# Altium schematic sheet 12_CONSOLE.SchDoc
size 420 x 297 mm; SheetNumber: 21; SheetTotal: 36
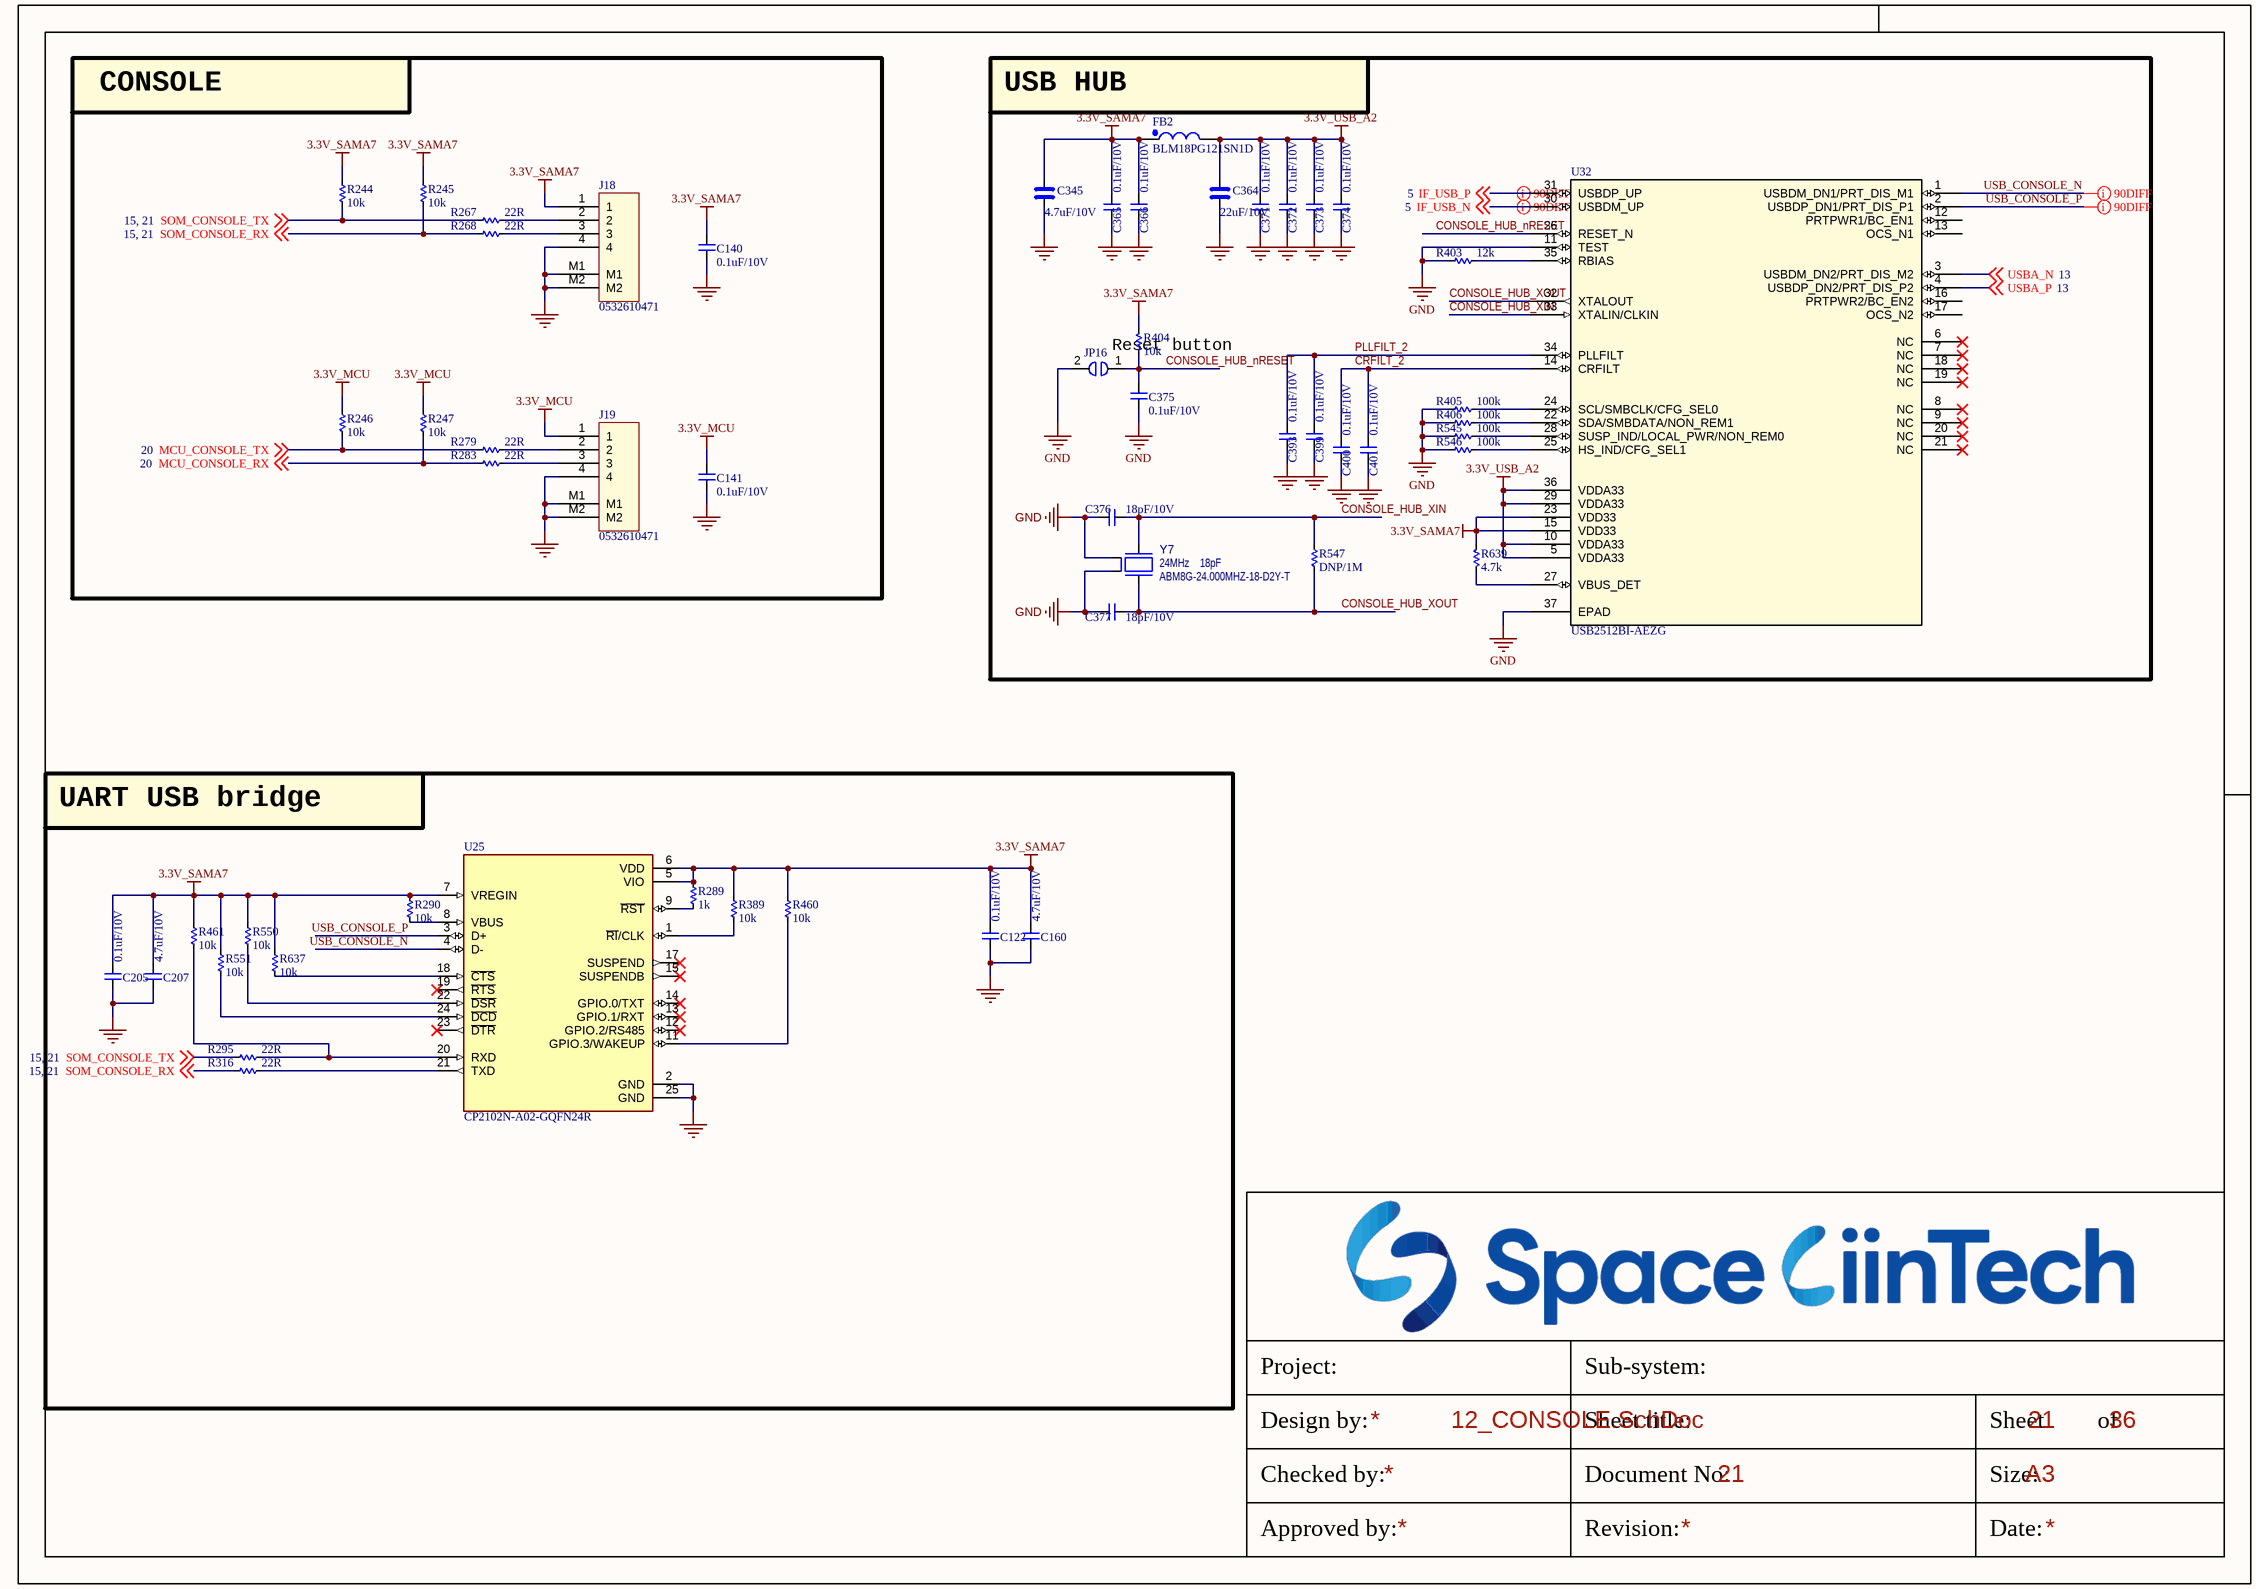
[diagram p0: 12_CONSOLE.SchDoc]

## Parts
C122  0.1uF/10V  [CAP_C_1005X60]
C140  0.1uF/10V  [CAP_C_1005X60]
C141  0.1uF/10V  [CAP_C_1005X60]
C160  4.7uF/10V  [CAP_C_1005X60]
C205  0.1uF/10V  [CAP_C_1005X60]
C207  4.7uF/10V  [CAP_C_1005X60]
C345  4.7uF/10V  [CAP_C_1608X80]
C364  22uF/10V  [CAP_C_1608X80]
C365  0.1uF/10V  [CAP_C_1005X60]
C366  0.1uF/10V  [CAP_C_1005X60]
C371  0.1uF/10V  [CAP_C_1005X60]
C372  0.1uF/10V  [CAP_C_1005X60]
C373  0.1uF/10V  [CAP_C_1005X60]
C374  0.1uF/10V  [CAP_C_1005X60]
C375  0.1uF/10V  [CAP_C_1005X60]
C376  18pF/10V  [CAP_C_1005X60]
C377  18pF/10V  [CAP_C_1005X60]
C393  0.1uF/10V  [CAP_C_1005X60]
C399  0.1uF/10V  [CAP_C_1005X60]
C400  0.1uF/10V  [CAP_C_1005X60]
C401  0.1uF/10V  [CAP_C_1005X60]
FB2  BLM18PG121SN1D  [IND_C_1608X60]
J18  0532610471  [MOLEX_0532610471]
J19  0532610471  [MOLEX_0532610471]
JP16  (no value)  [TESTPOINT_SHORT_120X100_60]
R244  10k  [RES_C_1005X40]
R245  10k  [RES_C_1005X40]
R246  10k  [RES_C_1005X40]
R247  10k  [RES_C_1005X40]
R267  22R  [RES_C_1005X40]
R268  22R  [RES_C_1005X40]
R279  22R  [RES_C_1005X40]
R283  22R  [RES_C_1005X40]
R289  1k  [RES_C_1005X40]
R290  10k  [RES_C_1005X40]
R295  22R  [RES_C_1005X40]
R316  22R  [RES_C_1005X40]
R389  10k  [RES_C_1005X40]
R403  12k  [RES_C_1005X40]
R404  10k  [RES_C_1005X40]
R405  100k  [RES_C_1005X40]
R406  100k  [RES_C_1005X40]
R460  10k  [RES_C_1005X40]
R461  10k  [RES_C_1005X40]
R545  100k  [RES_C_1005X40]
R546  100k  [RES_C_1005X40]
R547  DNP/1M  [RES_C_1005X40]
R550  10k  [RES_C_1005X40]
R551  10k  [RES_C_1005X40]
R637  10k  [RES_C_1005X40]
R639  4.7k  [RES_C_1005X40]
U25  CP2102N-A02-GQFN24R  [QFN50P400X400X80-25N]
U32  USB2512BI-AEZG  [QFN36_6X6MC_MCH]
Y7  value 24MHz  Load Capacitance: 18pF  Manufacturer Part Number 1: ABM8G-24.000MHZ-18-D2Y-T  [CRYSTAL_ABM8G]  (hidden comment: Crystal 4 Pins)

## Blocks framed on the sheet
CONSOLE: C140 C141 J18 J19 R244-R247 R267 R268 R279 R283
USB HUB: C345 C364-C366 C371-C377 C393 C399-C401 FB2 JP16 R403-R406 R545-R547 R639 U32 Y7
UART USB bridge: C122 C160 C205 C207 R289 R290 R295 R316 R389 R460 R461 R550 R551 R637 U25

## Nets
3.3V_MCU: C141.2 J19.1 R246.2 R247.2
3.3V_SAMA7: C122.1 C140.2 C160.1 C205.1 C207.1 C345.1 C365.2 C366.2 FB2.1 J18.1 R244.2 R245.2 R289.2 R290.2 R389.2 R404.1 R460.2 R461.2 R550.2 R551.2 R637.2 R639.1 U25.5(VIO) U25.6(VDD) U25.7(VREGIN) U32.15(VDD33) U32.23(VDD33)
3.3V_USB_A2: C364.1 C371.2 C372.2 C373.2 C374.2 FB2.2 U32.5(VDDA33) U32.10(VDDA33) U32.29(VDDA33) U32.36(VDDA33)
GND: C122.2 C140.1 C141.1 C160.2 C205.2 C207.2 C345.2 C364.2 C365.1 C366.1 C371.1 C372.1 C373.1 C374.1 C375.1 C376.2 C377.2 C393.1 C399.1 C400.1 C401.1 J18.4 J18.M1 J18.M2 J19.4 J19.M1 J19.M2 JP16.2 R403.1 R405.1 R406.1 R545.1 R546.1 U25.2(GND) U25.25(GND) U32.11(TEST) U32.37(EPAD) Y7.2(GND) Y7.4(GND)
CONSOLE_HUB_nRESET: C375.2 JP16.1 R404.2 U32.26(RESET_N)
CONSOLE_HUB_XIN: C376.1 R547.1 U32.33(XTALIN/CLKIN) Y7.3(Osc2)
CONSOLE_HUB_XOUT: C377.1 R547.2 U32.32(XTALOUT) Y7.1(Osc1)
CRFILT_2: C400.2 C401.2 U32.14(CRFILT)
IF_USB_N: U32.30(USBDM_UP) ; off-sheet IF_USB_N
IF_USB_P: U32.31(USBDP_UP) ; off-sheet IF_USB_P
MCU_CONSOLE_RX: R247.1 R283.2 ; off-sheet MCU_CONSOLE_RX
MCU_CONSOLE_TX: R246.1 R279.2 ; off-sheet MCU_CONSOLE_TX
PLLFILT_2: C393.2 C399.2 U32.34(PLLFILT)
SOM_CONSOLE_RX: R245.1 R268.2 R316.2 ; off-sheet SOM_CONSOLE_RX
SOM_CONSOLE_TX: R244.1 R267.2 R295.2 ; off-sheet SOM_CONSOLE_TX
USB_CONSOLE_N: U25.4(D-) U32.1(USBDM_DN1/PRT_DIS_M1)
USB_CONSOLE_P: U25.3(D+) U32.2(USBDP_DN1/PRT_DIS_P1)
USBA_N: U32.3(USBDM_DN2/PRT_DIS_M2) ; off-sheet USBA_N
USBA_P: U32.4(USBDP_DN2/PRT_DIS_P2) ; off-sheet USBA_P
NetJ18_2: J18.2 R267.1
NetJ18_3: J18.3 R268.1
NetJ19_2: J19.2 R279.1
NetJ19_3: J19.3 R283.1
NetR289_1: R289.1 U25.9(~{RST})
NetR290_1: R290.1 U25.8(VBUS)
NetR295_1: R295.1 R461.1 U25.20(RXD)
NetR316_1: R316.1 U25.21(TXD)
NetR389_1: R389.1 U25.1(~{RI}/CLK)
NetR403_2: R403.2 U32.35(RBIAS)
NetR405_2: R405.2 U32.24(SCL/SMBCLK/CFG_SEL0)
NetR406_2: R406.2 U32.22(SDA/SMBDATA/NON_REM1)
NetR460_1: R460.1 U25.11(GPIO.3/WAKEUP)
NetR545_2: R545.2 U32.28(SUSP_IND/LOCAL_PWR/NON_REM0)
NetR546_2: R546.2 U32.25(HS_IND/CFG_SEL1)
NetR550_1: R550.1 U25.22(~{DSR})
NetR551_1: R551.1 U25.24(~{DCD})
NetR637_1: R637.1 U25.18(~{CTS})
NetR639_2: R639.2 U32.27(VBUS_DET)

Not connected (* = marked no-connect by the designer): U25 12(GPIO.2/RS485)* 13(GPIO.1/RXT)* 14(GPIO.0/TXT)* 15(SUSPENDB)* 17(SUSPEND)* 19(~{RTS})* 23(~{DTR})*; U32 6(NC)* 7(NC)* 8(NC)* 9(NC)* 12(PRTPWR1/BC_EN1) 13(OCS_N1) 16(PRTPWR2/BC_EN2) 17(OCS_N2) 18(NC)* 19(NC)* 20(NC)* 21(NC)*

## Layout directives
differential pair; differential pair class DIFF90: IF_USB_N, IF_USB_P, USB_CONSOLE_N, USB_CONSOLE_P

## Notes on the sheet
- (near JP16) Reset button
- Project:
- Sub-system:
- Design by:
- Sheet title:
- Sheet
- of
- Checked by:
- Approved by:
- Revision:
- Document No:
- Size:
- Date:
- A3

## Library data of the parts
C122 C140 C141 C160 C205 C207 = _CAP_C_2: CAP
C345 C364 = _CAP_C_High_2: CAP CHIP High Value
C365 C366 C371-C377 C393 C399-C401 = _CAP_C_2: CAP CHIP
FB2 = _IND
J18 J19 = Header 4x1_2M
JP16 = JUMPER_1_1
R244-R247 R267 R268 R279 R283 R289 R290 R295 R316 R389 R403-R406 R460 R461 R545-R547 R550 R551 R637 R639 = _RES_B_2: RES
U25 = IC_USB_toUART_CP2102N-A02-GQFN24R: Value: *; MP: CP2102N-A02-GQFN24R; Package: None; Availability: Unavailable; Price: None
U32 = IC_USB_HUB_USB2512BI-AEZG: Description; Manufacturer_Name: Microchip; Copyright: Copyright (C) 2026 Ultra Librarian. All rights reserved.; Manufacturer_Part_Number: USB2512BI-AEZG; RefDes: RefDes; Type: Type
Y7 = OSC1047: Crystal; Manufacturer 1: Abracon Corporation; Description_: CRYSTAL 24MHz 18pF SMD ABM8G; Dev Tools Status: Production; Owner: Mark Loper; Populated: DNP; MCHP-ID: OSC1047; Revision: 1; Symbol: Crystal 4 Pins; Status: MCL Design; ComponentLink1URL: https://chn-vm-apps.microchip.com/mchprepo/parts/Datasheets/ABM8G.pdf; ComponentLink1Description: SVN Datasheet; ComponentLink2URL: C:\ALTIUM_WORK\00001_MCHP-CDB\Datasheets\ABM8G.pdf; ComponentLink2Description: Local Datasheet; ComponentLink3URL: C:\ALTIUM_WORK\00001_MCHP-CDB\Library\LibraryRefs\Crystal 4 Pins.SchLib; ComponentLink3Description: Open Symbol; ComponentLink4URL: C:\ALTIUM_WORK\00001_MCHP-CDB\Library\Footprints\CRYSTAL_ABM8G.PcbLib; ComponentLink4Description: Open Footprint; ComponentLink5Description: Open Footprint 2; ComponentLink6Description: Open Footprint 3; ComponentLink7Description: Open Footprint 4; Package: ABM8G; Type: Crystal; Category: Crystal/Oscillator; Supplier 1: Digi-Key; Supplier Part Number 1: 535-10273-1-ND; Quantity Override: 1